# EAGLE design L293D (EAGLE 6.5.0)
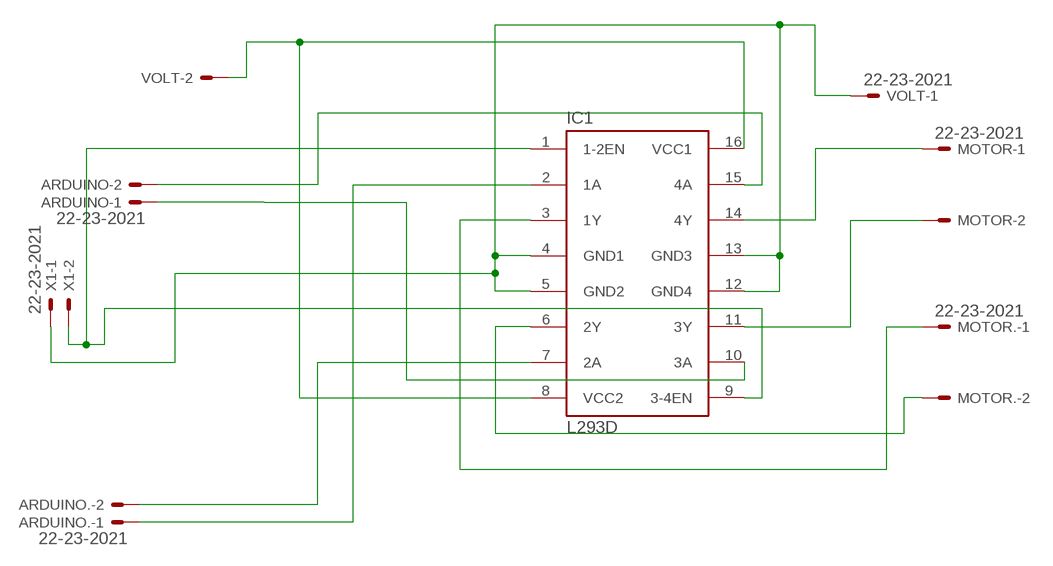
[diagram p0: schematic, sheet 1]

## Parts
ARDUINO  22-23-2021  [22-23-2021]
ARDUINO.  22-23-2021  [22-23-2021]
IC1  L293D  [DIL16]
MOTOR  22-23-2021  [22-23-2021]
MOTOR.  22-23-2021  [22-23-2021]
VOLT  22-23-2021  [22-23-2021]
X1  22-23-2021  [22-23-2021]

## Nets
GND: IC1.4(GND1) IC1.5(GND2) IC1.12(GND4) IC1.13(GND3) VOLT.1 X1.1
N$1: IC1.14(4Y) MOTOR.1
N$2: IC1.11(3Y) MOTOR.2
N$3: IC1.3(1Y) MOTOR..1
N$4: IC1.6(2Y) MOTOR..2
N$5: ARDUINO.2 IC1.15(4A)
N$6: ARDUINO.1 IC1.10(3A)
N$8: IC1.8(VCC2) IC1.16(VCC1) VOLT.2
N$9: ARDUINO..1 IC1.2(1A)
N$10: ARDUINO..2 IC1.7(2A)
N$12: IC1.1(1-2EN) IC1.9(3-4EN) X1.2

## Library data of the parts
ARDUINO ARDUINO. MOTOR MOTOR. VOLT X1 = con-molex:22-23-2021: .100" (2.54mm) Center Header - 2 Pin; MF: MOLEX; MPN: 22-23-2021; OC_FARNELL: 1462926; OC_NEWARK: 25C3832
IC1 = st-microelectronics:L293D: PUSH-PULL 4 CHANNEL DRIVER; MPN: L293D; OC_FARNELL: 9589619; OC_NEWARK: 56P8249

## Board
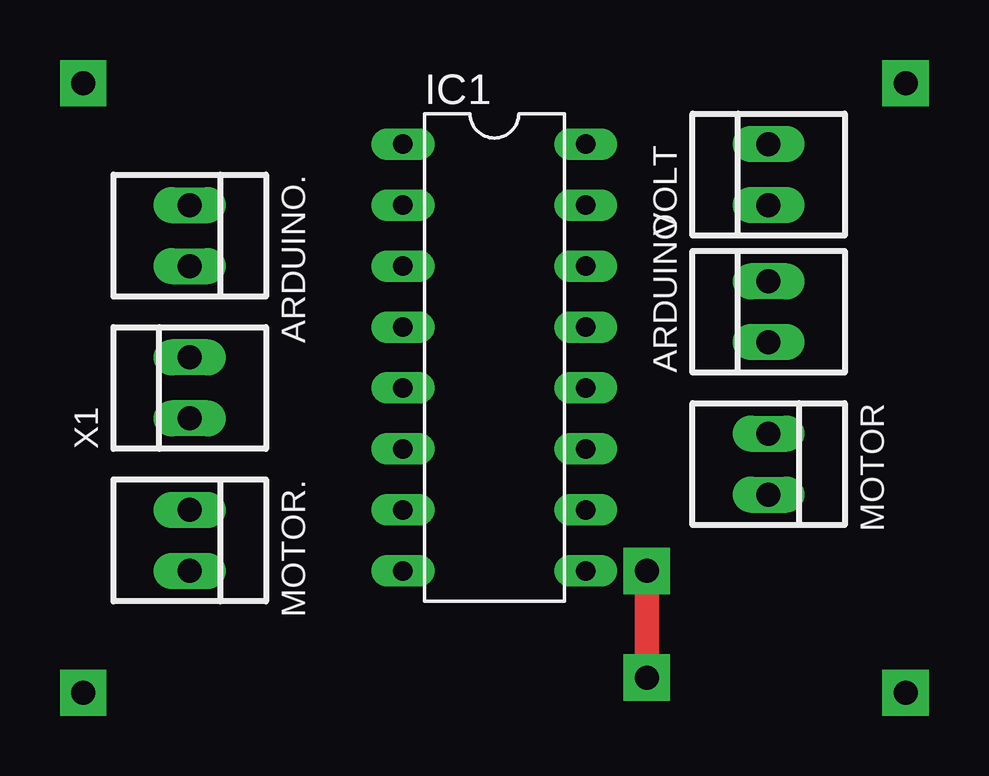
[diagram p1: board, top side]
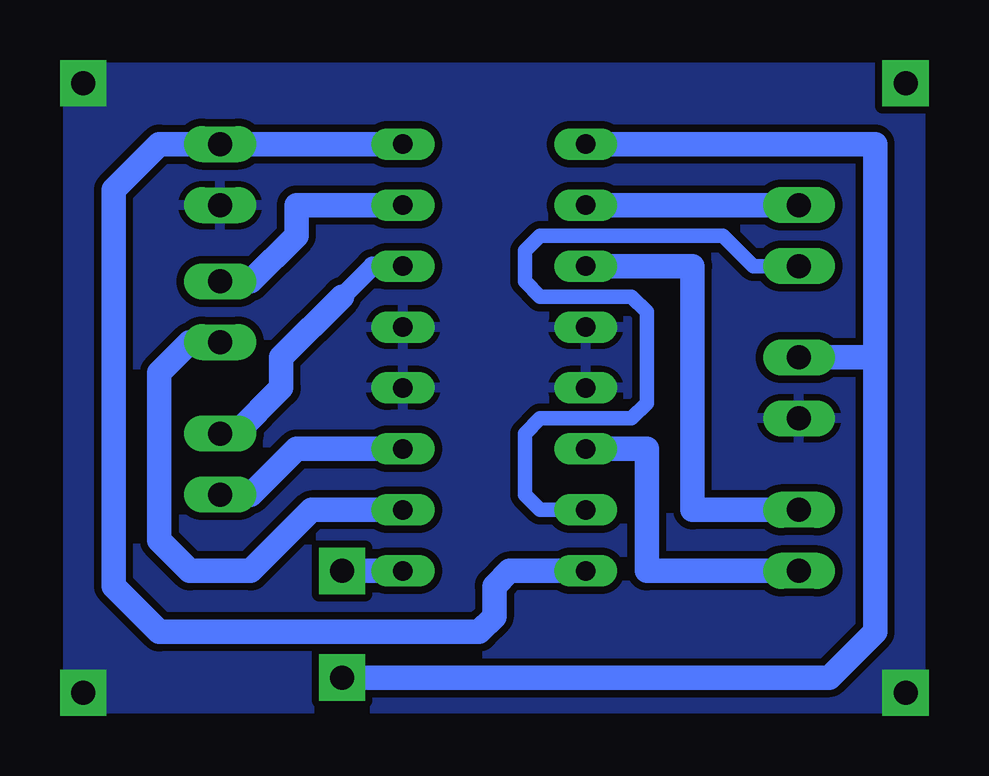
[diagram p2: board, bottom side, seen from below]

No outline drawn. Coordinates in mm, seen from the top.
Copper layers (1*16): Top 0.035mm / dielectric 1.5mm / Bottom 0.035mm
Design rules "default": minimum track width 10mil, minimum drill 24mil, track to track 8mil, track to pad 8mil, pad to pad 8mil, via to via 8mil, smd to smd 8mil, copper to edge 40mil, drill to drill 8mil, minimum pad ring 10mil, minimum via ring 8mil, stop-mask expansion 4mil, vias tented up to drill 0mil, thermal gap 10mil

### Footprints (pad centres in the part's own frame; a part is rotated, then mirrored left to right if it is on the bottom)
22-23-2021 = drill 1 long: 1 -1.27,0; 2 1.27,0
DIL16 = drill 0.813 long: 1 -8.89,-3.81; 2 -6.35,-3.81; 3 -3.81,-3.81; 4 -1.27,-3.81; 5 1.27,-3.81; 6 3.81,-3.81; 7 6.35,-3.81; 8 8.89,-3.81; 9 8.89,3.81; 10 6.35,3.81; 11 3.81,3.81; 12 1.27,3.81; 13 -1.27,3.81; 14 -3.81,3.81; 15 -6.35,3.81; 16 -8.89,3.81

### Placement (x,y rotation side)
ARDUINO  29.21,16.51 90 top
ARDUINO.  5.08,19.68 270 top
IC1  17.78,14.61 270 top
MOTOR  29.21,10.16 270 top
MOTOR.  5.08,6.99 270 top
VOLT  29.21,22.23 90 top
X1  5.08,13.34 90 top

### Tracks (layer width: path | path; a pad name or v marks a point on that pad's centre or on a via)
GND  (via drill 1 pad 1.93)
  other vias: 34.92,26.04 34.92,0.64 0.64,0.64
  pour Bottom (isolate 0.305): 35.56,0 0,0 0,26.67 35.56,26.67
N$1
  Bottom 0.813: IC1.14 22.86,18.41 24.13,17.14
  Bottom 1.016: MOTOR.1 28.57,11.43 26.67,13.34 26.67,14.61 24.13,17.14
N$2
  Bottom 1.016: MOTOR.2 27.94,8.89 26.04,10.79 IC1.11
N$3
  Bottom 1.016: MOTOR..1 9.53,8.26 9.53,18.41 IC1.3
N$4
  Bottom 1.016: MOTOR..2 11.43,5.71 11.43,10.79 IC1.6
N$5
  Bottom 1.016: IC1.15 26.04,20.95 26.04,19.68 27.94,17.78 ARDUINO.2
N$6
  Bottom 1.016: IC1.10 25.4,8.26 27.94,5.71 30.48,5.71 31.75,6.99 31.75,13.97 30.48,15.24 ARDUINO.1
N$7  (via drill 1 pad 1.93)
  other vias: 0.64,26.04
N$8
  Bottom 1.016: IC1.16 VOLT.2 31.75,23.5 33.66,21.59 33.66,5.08 31.75,3.17 18.41,3.17 17.78,3.81 17.78,5.08 17.14,5.71 IC1.8
N$9
  Bottom 1.016: ARDUINO..1 IC1.2
N$10
  Bottom 0.61: ARDUINO..2 6.99,18.41 8.26,19.68 15.88,19.68 16.51,19.05 16.51,17.78 15.88,17.14 12.06,17.14 11.43,16.51 11.43,12.7 12.06,12.06 15.88,12.06 16.51,11.43 16.51,8.89 15.88,8.26 IC1.7
N$12  (via drill 1 pad 1.93)
  Top 1.016: v24.13,5.71 v24.13,1.27
  Bottom 1.016: X1.2 1.91,14.61 | 1.91,14.61 1.91,23.5 IC1.1 | 1.91,14.61 1.91,3.17 3.81,1.27 v24.13,1.27 | IC1.9 v24.13,5.71